# EAGLE schematic zza (EAGLE 7.2.0)
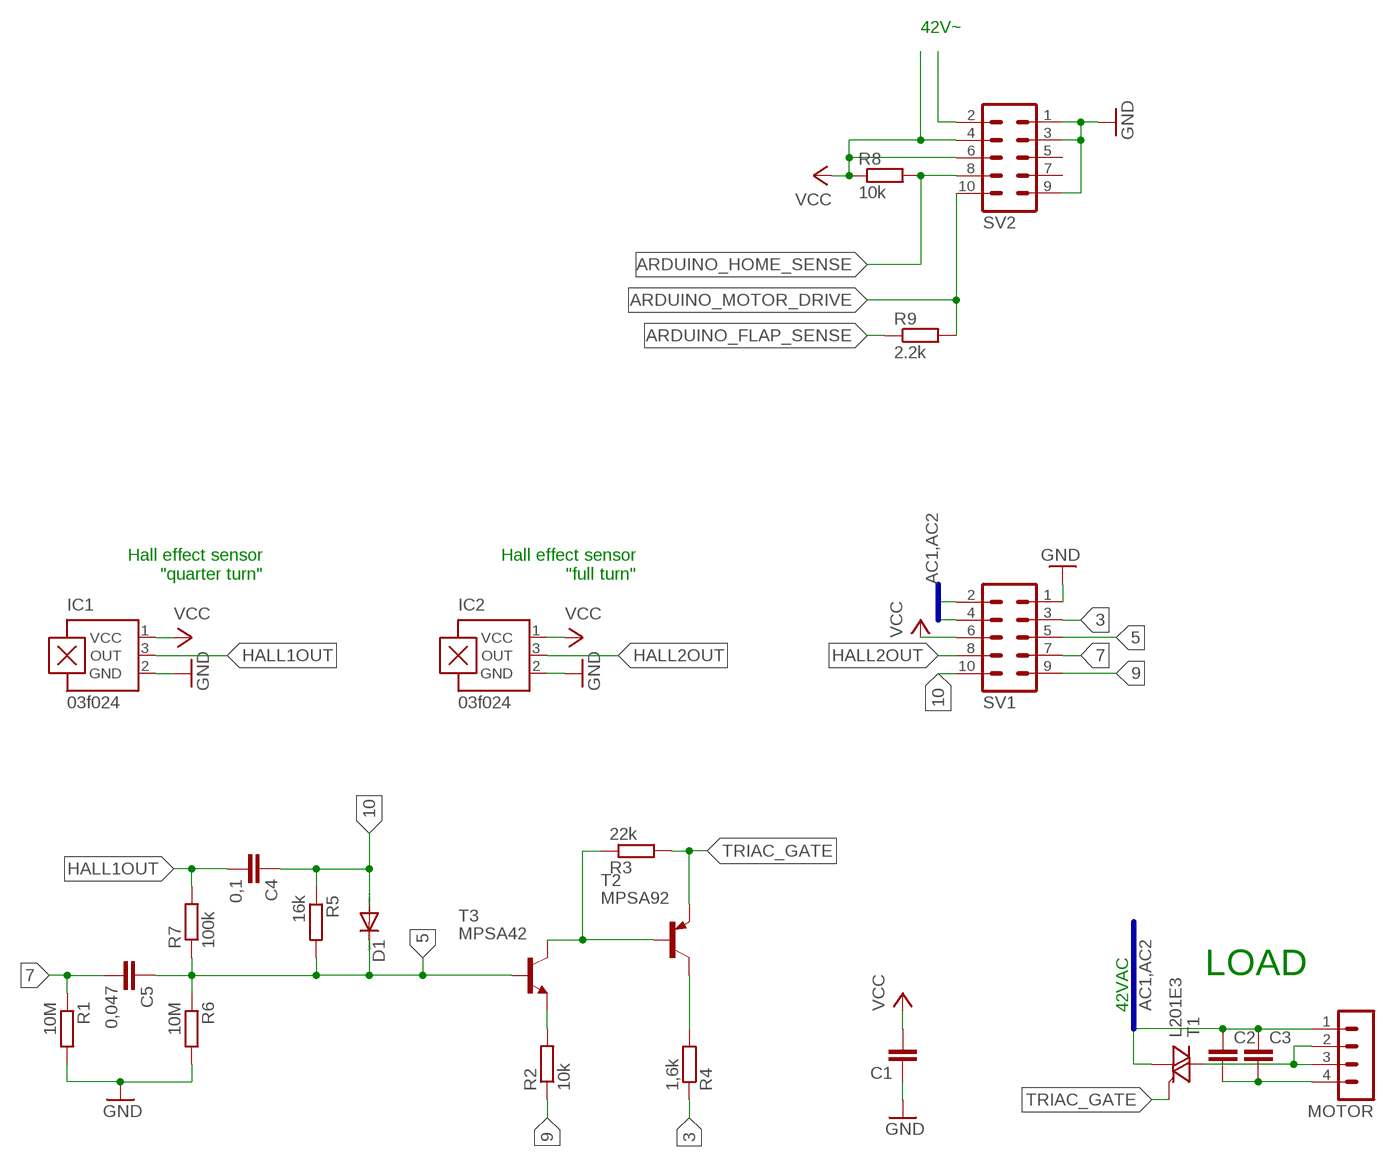
[diagram p0: schematic, sheet 1]

## Parts
C1  C-EU025-024X044  [C025-024X044]
C2  C-EU375-155X418  [C375-155X418]
C3  C-EU075-052X106  [C075-052X106]
C4  0,1  C-EU025-024X044  [C025-024X044]
C5  0,047  C-EU025-024X044  [C025-024X044]
D1  1N4004  [DO41-10]
IC1  03f024  A1301UA  [SIP3-UA]
IC2  03f024  A1301UA  [SIP3-UA]
MOTOR  MA04-1  [MA04-1]
R1  10M  R-EU_0207/10  [0207/10]
R2  10k  R-EU_0207/10  [0207/10]
R3  22k  R-EU_0207/10  [0207/10]
R4  1,6k  R-EU_0207/10  [0207/10]
R5  16k  R-EU_0207/10  [0207/10]
R6  10M  R-EU_0207/10  [0207/10]
R7  100k  R-EU_0207/10  [0207/10]
R8  10k  R-EU_0204/2V  [0204V]
R9  2.2k  R-EU_0204/2V  [0204V]
SV1  MA05-2  [MA05-2]
SV2  MA05-2  [MA05-2]
T1  L201E3  BT138-V  [TO220BV]
T2  MPSA92  MPSA92-PNP-TO92-EBC  [TO92-EBC]
T3  MPSA42  MPSA42-NPN-TO92-EBC  [TO92-EBC]

## Nets
3: R4.1 SV1.3
5: C5.1 D1.C R5.2 R6.1 R7.1 SV1.5 T3.B
7: C5.2 R1.1 SV1.7
9: R2.1 SV1.9
10: C4.1 D1.A R5.1 SV1.10
AC1: SV1.4 T1.T1(A1)
AC2: C2.1 C3.1 MOTOR.1 SV1.2
ARDUINO_FLAP_SENSE: R9.1
ARDUINO_HOME_SENSE: R8.2 SV2.8
ARDUINO_MOTOR_DRIVE: R9.2 SV2.10
GND: C1.1 IC1.2(GND) IC2.2(GND) R1.2 R6.2 SV1.1 SV2.1 SV2.3 SV2.9
HALL1OUT: C4.2 IC1.3(OUT) R7.2
HALL2OUT: IC2.3(OUT) SV1.8
N$1: R3.1 T2.B T3.C
N$2: T1.G
N$3: SV2.2
N$5: MOTOR.2 MOTOR.3 T1.T2(A2)
N$6: C2.2 C3.2 MOTOR.4
N$11: R4.2 T2.C
N$12: R2.2 T3.E
TRIAC_GATE: R3.2 T2.E
VCC: C1.2 IC1.1(VCC) IC2.1(VCC) R8.1 SV1.6 SV2.4 SV2.6
Unconnected: SV2.5 SV2.7

## Buses
AC1,AC2

## Notes on the sheet
- 42V~
- Hall effect sensor
  "quarter turn"
- Hall effect sensor
  "full turn"
- 42VAC
- LOAD

## Library data of the parts
C1-C5 = rcl:C-EU: CAPACITOR, European symbol
D1 = diode:1N4004: DIODE general purpose rectifier, 1 A
IC1 IC2 = allegro:A13*?: Linear Hall Effect Sensor ICs Continuous-Time Ratiometric High-Temperature Operation Programmable Linear with Analog Output A1302 -Replacement- UGN3503 Source: http://www.allegromicro.com/en/Products/Part_Numbers/1301/1301.pdf http://www.allegromicro.com/en/Products/Part_Numbers/1321/1321.pdf http://www.allegromicro.com/en/Products/Part_Numbers/1381/1381.pdf; MF: ALLEGRO MICROSYSTEMS, INC.; MPN: A1301EUA-T; OC_FARNELL: 1198085; OC_NEWARK: 31K6635
MOTOR = con-lstb:MA04-1: PIN HEADER; OC_FARNELL: unknown; OC_NEWARK: unknown
R1-R9 = rcl:R-EU_: RESISTOR, European symbol
SV1 SV2 = con-lstb:MA05-2: PIN HEADER; OC_FARNELL: unknown; OC_NEWARK: unknown
T1 = triac:BT138: TRIAC Source: http://www.semiconductors.philips.com BT138_SERIES_2.pdf
T2 = transistor:*-PNP-: PNP Transistror
T3 = transistor:*-NPN-: NPN Transistror BF959 corrected 2008.03.06